# EAGLE design linefollower analog1 (EAGLE 6.6.0)
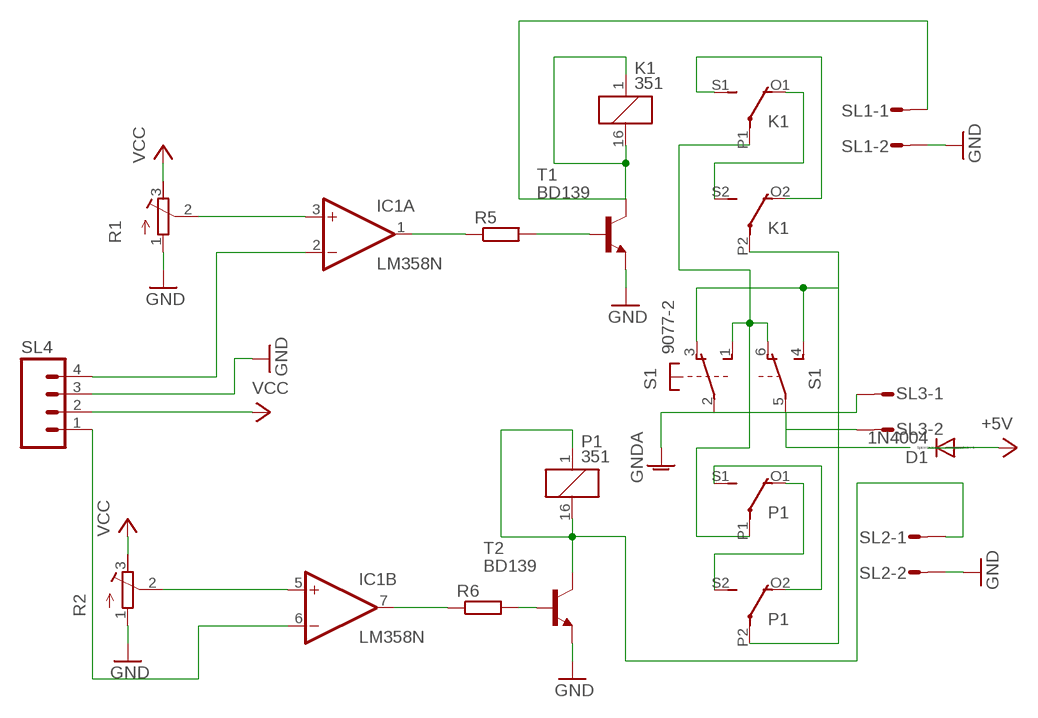
[diagram p0: schematic, sheet 1]

## Parts
D1  1N4004  [DO41-10]
IC1  LM358N  [DIL08]
K1  351  [351]
P1  351  [351]
R1  R-TRIMM3339P  [RTRIM3339P]
R2  R-TRIMM3339P  [RTRIM3339P]
R5  R-EU_0207/7  [0207/7]
R6  R-EU_0207/7  [0207/7]
S1  9077-2  [9077-2]
SL1  M02S  [02P]
SL2  M02S  [02P]
SL3  M02S  [02P]
SL4  M04  [04P]
T1  BD139  [TO126]
T2  BD139  [TO126]

## Nets
+5V: D1.A D1.C
GND: R1.1(E) R2.1(E) SL1.2 SL2.2 SL4.3 T1.1(E) T2.1(E)
GNDA: S1.2(1:P) SL3.1
N$1: IC1.1(A:OUT) R5.1
N$2: IC1.3(A:+IN) R1.2(S)
N$3: IC1.7(B:OUT) R6.1
N$4: IC1.5(B:+IN) R2.2(S)
N$5: R5.2 T1.3(B)
N$6: R6.2 T2.3(B)
N$8: K1.1 K1.16 SL1.1 T1.2(C)
N$9: S1.5(2:P) SL3.2
N$11: K1.O2(3:O) K1.S1(2:S)
N$12: K1.O1(2:O) K1.S2(3:S)
N$13: K1.P1(2:P) P1.P1(2:P) S1.1(1:S) S1.6(2:O)
N$14: K1.P2(3:P) P1.P2(3:P) S1.3(1:O) S1.4(2:S)
N$15: P1.O2(3:O) P1.S1(2:S)
N$16: P1.O1(2:O) P1.S2(3:S)
N$18: IC1.2(A:-IN) SL4.4
N$22: IC1.6(B:-IN) SL4.1
P1: P1.1 P1.16 SL2.1 T2.2(C)
VCC: R1.3(A) R2.3(A) SL4.2

## Power pins joined to a net without a drawn wire
V+: IC1.8(P:V+)
V-: IC1.4(P:V-)

## Library data of the parts
D1 = diode:1N4004: DIODE general purpose rectifier, 1 A
IC1 = linear:LM358: OP AMP also LM158; LM258; LM2904 Source: http://cache.national.com/ds/LM/LM158.pdf
K1 P1 = relay:351: RELAY 2 x switch, Omron; OC_FARNELL: unknown; OC_NEWARK: unknown
R1 R2 = resistor:R-TRIMM: Trimm resistor
R5 R6 = resistor:R-EU_: RESISTOR, European symbol
S1 = switch-misc:9077-2: MARQUARDT SWITCH 9077.0200 Distributor: Buerklin <https://www.buerklin.com/default.asp?event=ShowArtikel%2812G2822%29&l=d&jump=ArtNr_12G2822>
SL1-SL3 = con-amp-quick:M02S: AMP QUICK CONNECTOR; OC_FARNELL: unknown; OC_NEWARK: unknown
SL4 = con-amp-quick:M04: AMP QUICK CONNECTOR; OC_FARNELL: unknown; OC_NEWARK: unknown
T1 T2 = transistor:BD139: NPN TRANSISTOR

## Board
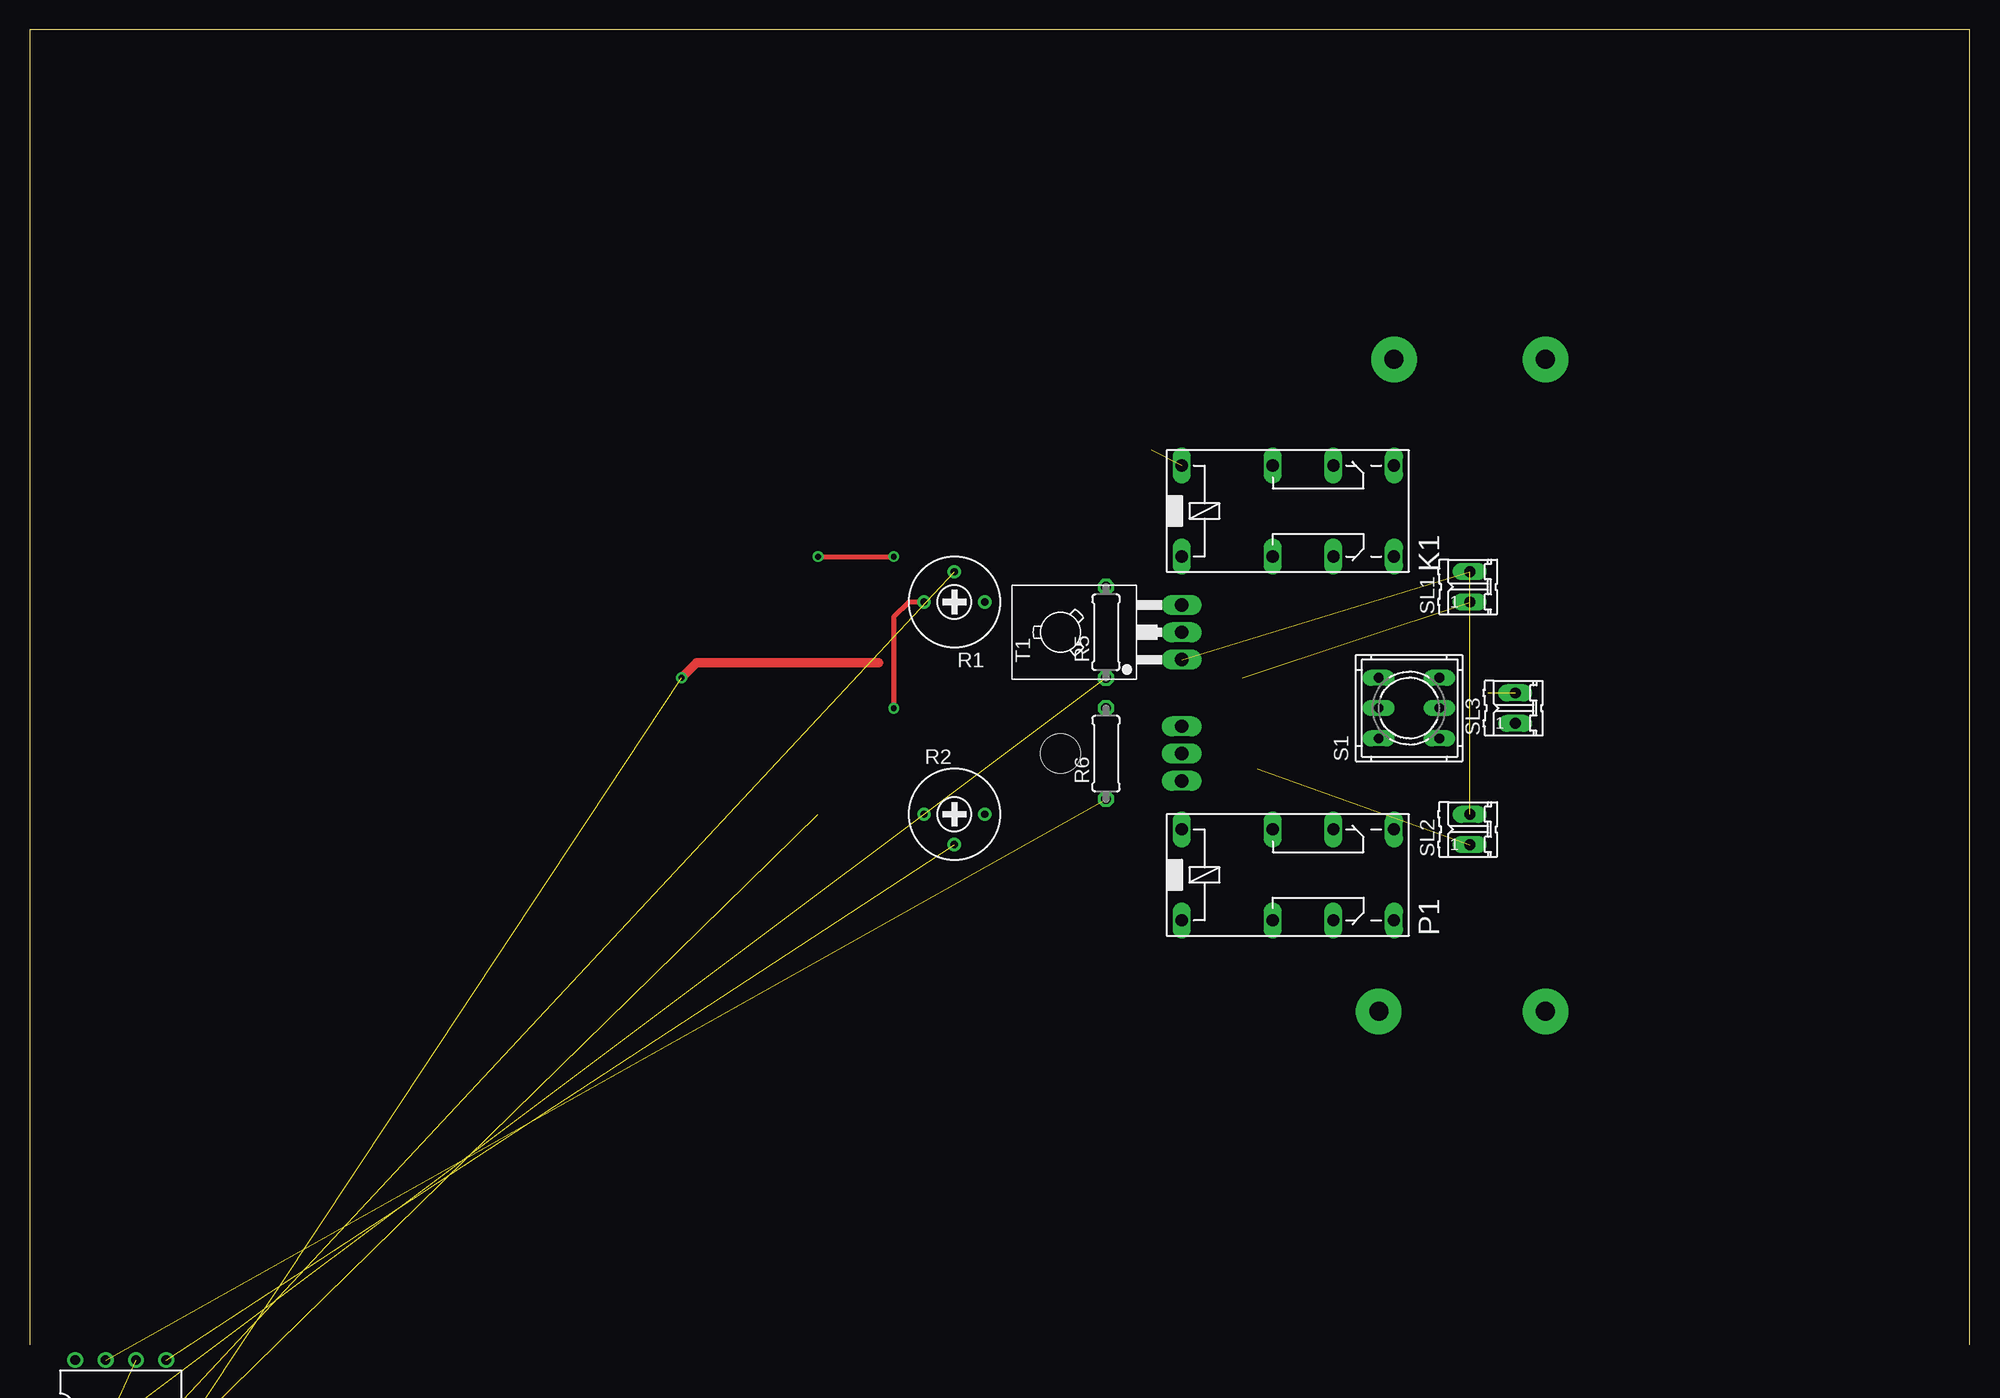
[diagram p1: board, top side]
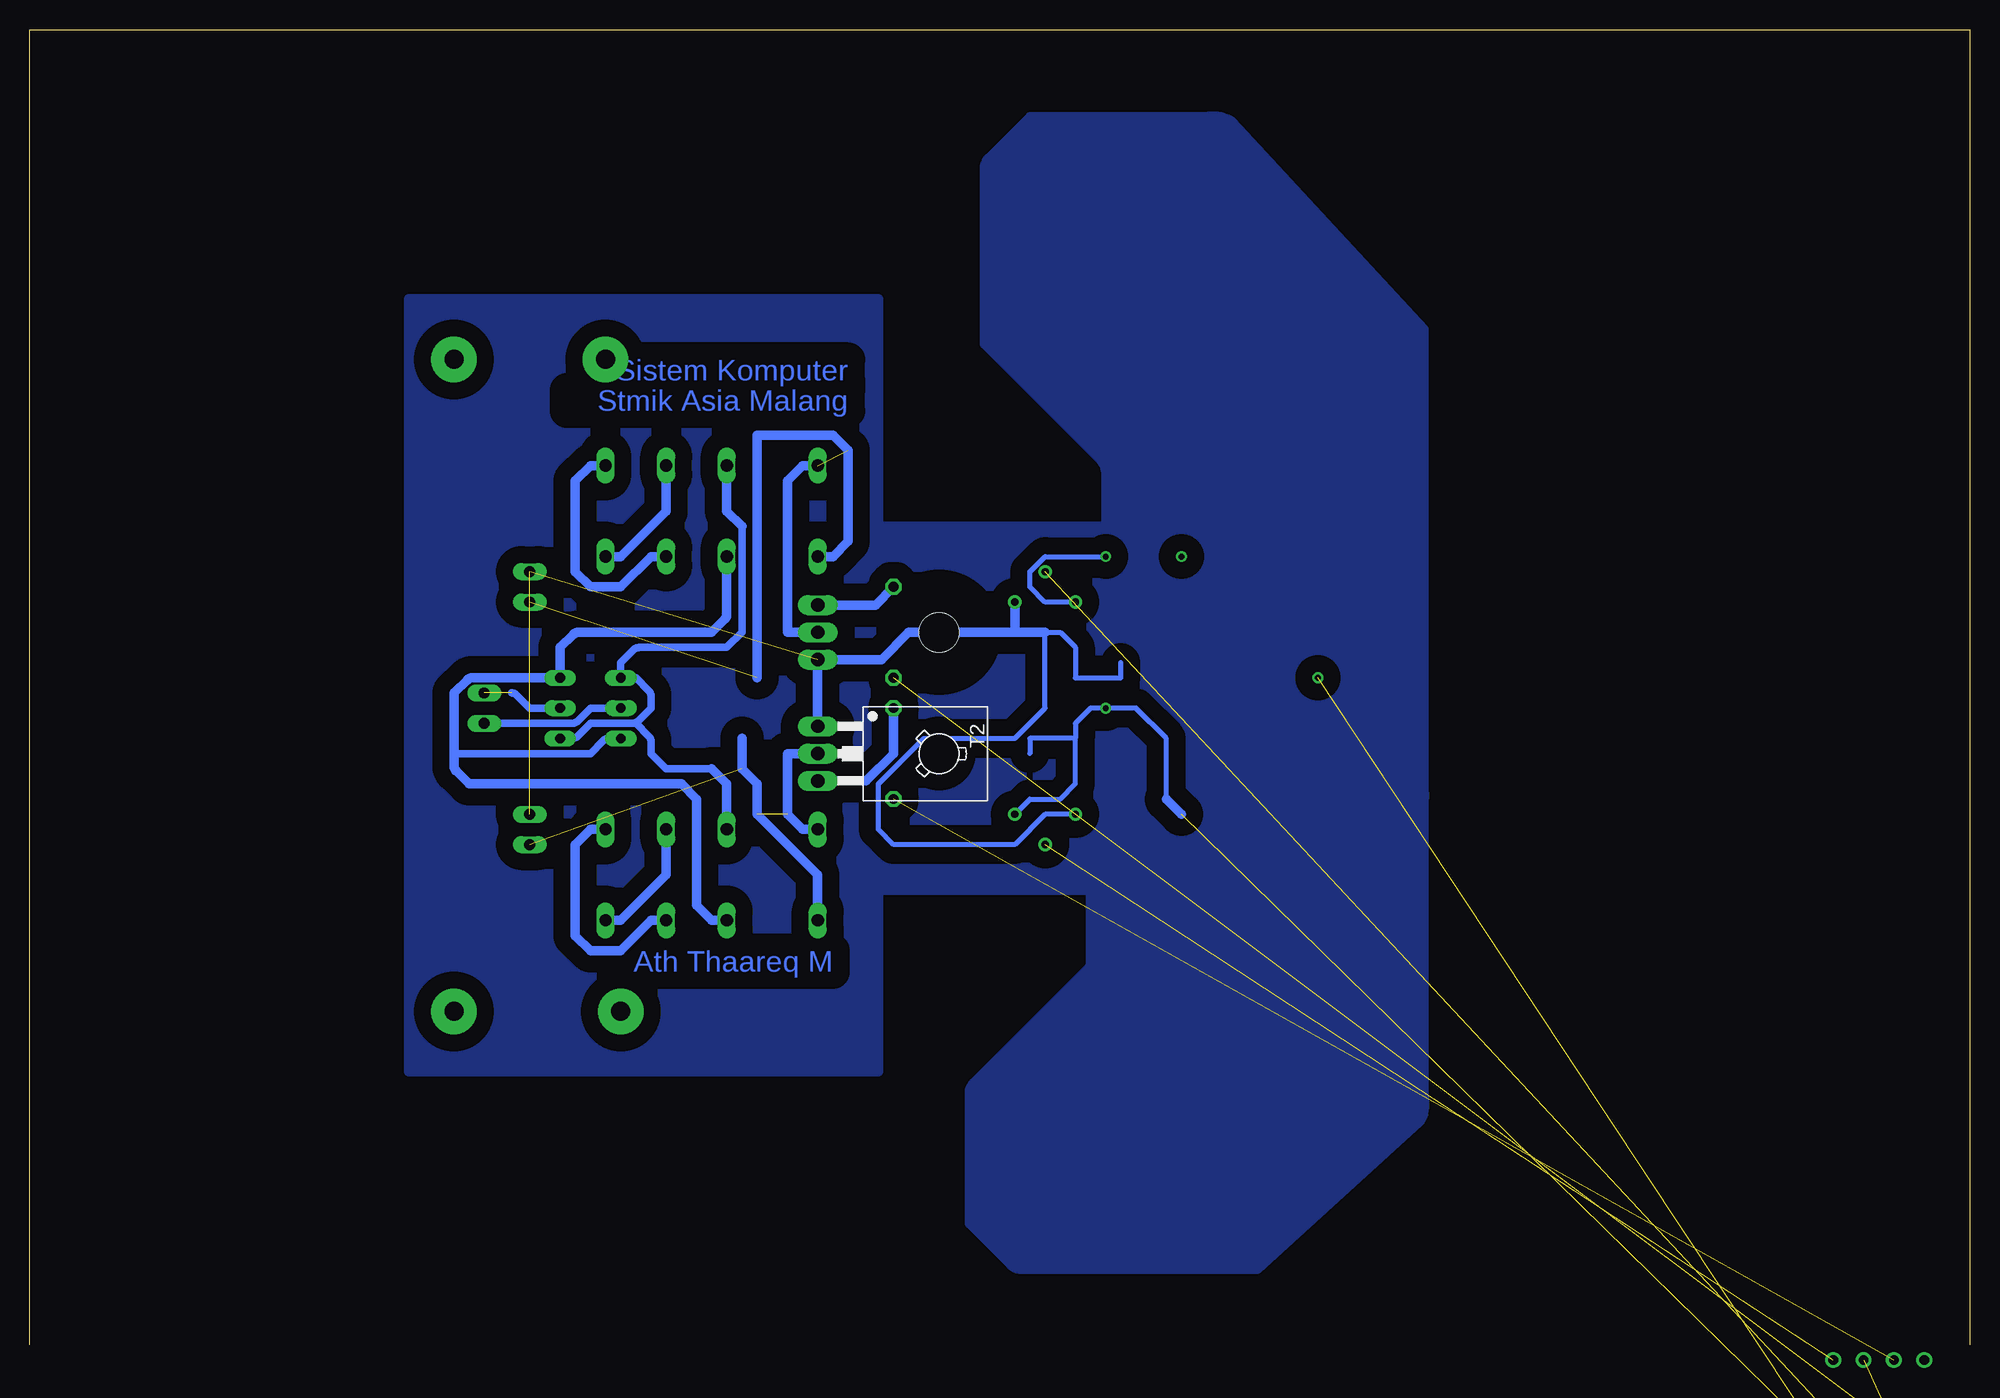
[diagram p2: board, bottom side, seen from below]

Size 162.54 x 110.16 mm. Coordinates in mm from the lower left corner, seen from the top.
Outline: 162.54,0 162.54,110.16 0,110.16 0,0
Copper layers (1*16): Top 0.035mm / dielectric 1.5mm / Bottom 0.035mm
Design rules "default": minimum track width 10mil, minimum drill 24mil, track to track 8mil, track to pad 8mil, pad to pad 8mil, via to via 8mil, smd to smd 8mil, copper to edge 40mil, drill to drill 8mil, minimum pad ring 10mil, minimum via ring 8mil, stop-mask expansion 4mil, vias tented up to drill 0mil, thermal gap 10mil

### Footprints (pad centres in the part's own frame; a part is rotated, then mirrored left to right if it is on the bottom)
DO41-10 = drill 1.118: A 5.08,0; C -5.08,0
DIL08 = drill 0.813 pad 1.27: 1 -3.81,-3.81; 2 -1.27,-3.81; 3 1.27,-3.81; 4 3.81,-3.81; 5 3.81,3.81; 6 1.27,3.81; 7 -1.27,3.81; 8 -3.81,3.81
351 = drill 1.016 long: 1 -3.81,-3.81; 16 -3.81,3.81; O1 8.89,-3.81; O2 8.89,3.81; P1 3.81,-3.81; P2 3.81,3.81; S1 13.97,-3.81; S2 13.97,3.81
RTRIM3339P = drill 0.61: 1 -2.54,0; 2 0,-2.54; 3 2.54,0
0207/7 = drill 0.813 octagon: 1 -3.81,0; 2 3.81,0
9077-2 = drill 0.813 long: 1 -2.54,2.54; 2 0,2.54; 3 2.54,2.54; 4 -2.54,-2.54; 5 0,-2.54; 6 2.54,-2.54
02P = drill 0.914 long: 1 -1.27,0; 2 1.27,0
04P = drill 0.914 long: 1 -3.81,0; 2 -1.27,0; 3 1.27,0; 4 3.81,0
TO126 = drill 1.118 long: 1 -2.286,-5.08; 2 0,-5.08; 3 2.286,-5.08 | hole 3.302: 0,5.08

### Placement (x,y rotation side)
D1  6.35,-21.59 0 top  (outside the outline)
IC1  7.62,-5.08 0 top
K1  100.33,69.85 0 top
P1  100.33,39.37 0 top
R1  77.47,62.23 180 top
R2  77.47,44.45 0 top
R5  90.17,59.69 90 top
R6  90.17,49.53 90 top
S1  115.57,53.34 90 top
SL1  120.65,63.5 90 top
SL2  120.65,43.18 90 top
SL3  124.46,53.34 90 top
SL4  6.35,-15.24 0 top  (outside the outline)
T1  91.44,59.69 90 top
T2  91.44,49.53 270 bottom

### Tracks (layer width: path | path; a pad name or v marks a point on that pad's centre or on a via)
+5V  (1 unrouted)
GND  (via drill 0.5 pad 0.25)  (4 unrouted)
  Top 0.813: 71.12,57.15 55.88,57.15 v54.61,55.88
  Bottom 0.406: 71.12,57.15 71.12,55.88 74.93,55.88 74.93,58.42 76.2,59.69 77.47,59.69 77.47,53.34 80.01,50.8 87.63,50.8 91.44,46.99 91.44,43.18 90.17,41.91 80.01,41.91 77.47,44.45 R2.1
  Bottom 0.813: T2.1 T1.1 91.19,57.4 88.9,59.69 80.01,59.69 | 80.01,59.69 77.47,59.69 | R1.1 80.01,59.69
GNDA
  Bottom 0.61: SL3.1 117.1,52.07 arc-45 116.65,52.26 115.57,53.34 S1.2
N$1  (1 unrouted)
N$2  (1 unrouted)
N$3  (1 unrouted)
N$4  (1 unrouted)
N$5
  Bottom 0.813: T1.3 91.69,61.98 R5.2
N$6
  Bottom 0.813: T2.3 92.46,47.24 90.17,49.53 R6.2
N$7
  pour Bottom (isolate 1.422): 45.72,45.72 45.72,20.85 arc45 46.09,18.68 59.69,6.35 79.48,6.35 arc45 80.38,6.72 83.82,10.16 83.82,21.06 arc45 83.45,21.96 73.66,31.75 73.66,38.1 91.44,38.1 91.44,22.86 130.81,22.86 130.81,87.63 91.44,87.63 91.44,68.58 72.39,68.58 72.39,73.13 arc-45 72.76,74.03 82.55,83.82 82.55,98.53 arc45 82.18,99.43 78.74,102.87 64.03,102.87 arc45 61.86,102.5 45.72,85.09 45.72,46.25 arc45
N$8  (2 unrouted)
  Bottom 0.813: T1.2 99.06,59.69 99.06,72.39 97.79,73.66 K1.16 | 101.6,55.88 101.6,76.2 95.25,76.2 93.98,74.93 93.98,67.31 95.25,66.04 K1.1
N$9  (1 unrouted)
  Bottom 0.61: 122.18,54.61 arc45 121.73,54.42 120.65,53.34 S1.5
N$11
  Bottom 0.813: K1.O2 109.22,69.85 113.03,66.04 K1.S1
N$12
  Bottom 0.813: K1.S2 115.57,73.66 116.84,72.39 116.84,64.77 115.57,63.5 113.03,63.5 110.49,66.04 K1.O1
N$13
  Bottom 0.61: S1.1 114.04,50.8 arc-45 114.49,50.61 115.57,49.53 127,49.53
  Bottom 0.813: P1.P1 105.41,35.56 106.68,36.83 106.68,45.72 107.95,46.99 125.73,46.99 126.81,48.07 arc45 127,48.52 127,49.53 127,54.61 125.92,55.69 arc45 125.47,55.88 S1.6 118.11,58.42 117.03,59.5 arc45 116.58,59.69 105.41,59.69 104.33,60.77 arc-45 104.14,61.22 K1.P1
N$14
  Bottom 0.61: 102.87,68.58 102.87,59.69 104.14,58.42 111.5,58.42 arc-45 111.95,58.23 113.03,57.15 S1.3 111.76,55.88 110.68,54.8 arc45 110.49,54.35 110.49,53.34 111.57,52.26 arc45 112.02,52.07 | 105.41,48.26 109.22,48.26 110.49,49.53 110.49,50.54 arc-45 110.68,50.99 111.76,52.07 112.02,52.07 | S1.4 117.1,50.8 arc-45 116.65,50.99 115.57,52.07 112.02,52.07
  Bottom 0.813: K1.P2 104.14,69.85 102.87,68.58 | P1.P2 104.14,46.99 105.41,48.26
N$15
  Bottom 0.813: P1.S1 113.03,35.56 109.22,39.37 P1.O2
N$16
  Bottom 0.813: P1.O1 110.49,35.56 113.03,33.02 115.57,33.02 116.84,34.29 116.84,41.91 115.57,43.18 P1.S2
N$17  (via drill 1.6 pad 3.81)
  other vias: 127,27.94
N$18  (1 unrouted)
N$19
  pour Bottom (isolate 1.422): 91.44,81.28 91.44,77.47
N$20  (via drill 1.6 pad 3.81)
  other vias: 113.03,27.94
N$21  (via drill 1.6 pad 3.81)
  other vias: 127,82.55
N$22  (1 unrouted)
N$23  (via drill 1.6 pad 3.81)
  other vias: 114.3,82.55
P1  (2 unrouted)
  Bottom 0.813: P1.16 97.79,43.18 99.06,44.45 99.06,49.53 T2.2 | 102.87,50.8 102.87,48.26 101.6,46.99 101.6,44.45 96.52,39.37 P1.1
VCC  (via drill 0.5 pad 0.25)  (1 unrouted)
  Top 0.406: v66.04,66.04 v72.39,66.04 | R1.3 73.66,62.23 72.39,60.96 v72.39,53.34
  Bottom 0.406: R2.3 78.74,45.72 76.2,45.72 74.93,46.99 74.93,50.8 | 74.93,50.8 78.74,50.8 78.74,49.53 | 67.31,45.72 67.31,50.8 69.85,53.34 v72.39,53.34 73.66,53.34 74.93,52.07 74.93,50.8 | R1.3 77.47,62.23 78.74,63.5 78.74,64.77 77.47,66.04 v72.39,66.04
  Bottom 0.813: 66.04,44.45 67.31,45.72

### Text on the board
Bottom: Sistem Komputer | Stmik Asia Malang | Ath Thaareq M